# Altium schematic sheet PowerSupply.SchDoc: TermoDeep - Power Supply
size A4; Revision: V1.0 Rev A; Proyect DSD: TermoDeep; Version: V 1.0  Rev A
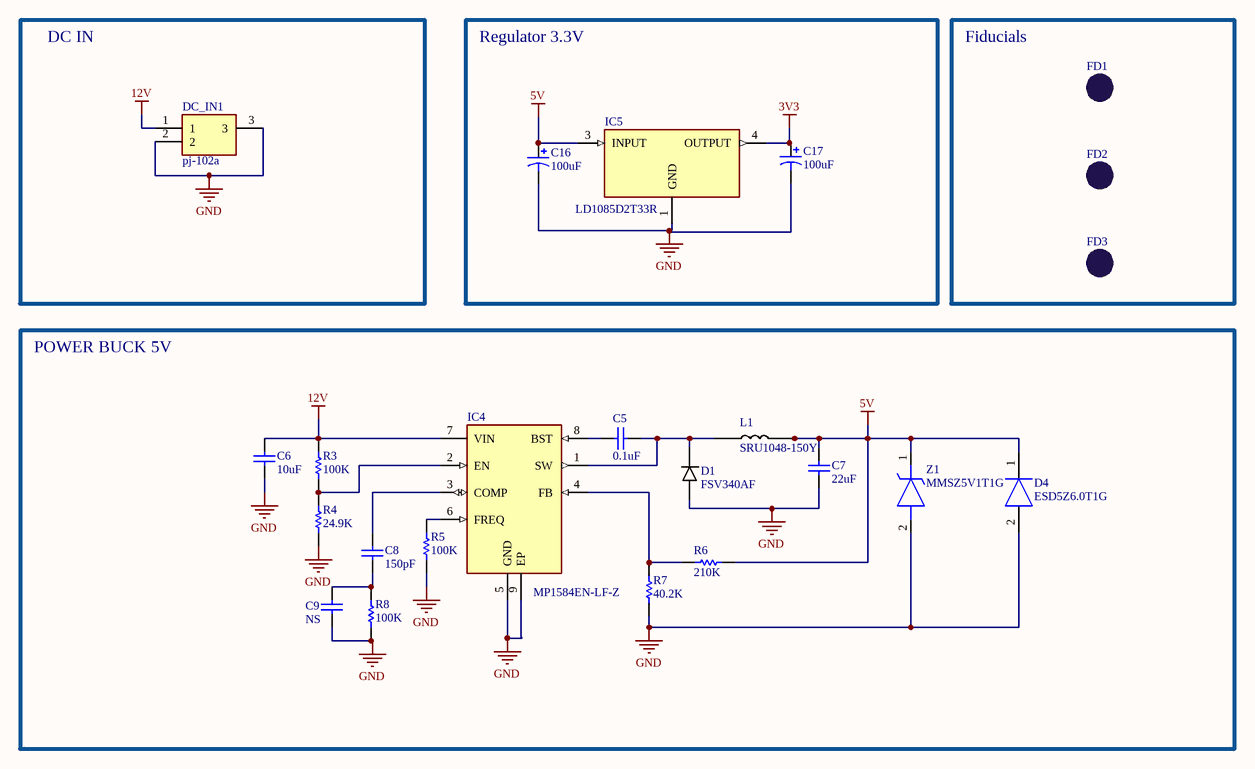
[diagram p0: PowerSupply.SchDoc]

## Parts
C5  0.1uF  [C0603_N]
C6  10uF  [C0805_N]
C7  22uF  [C0805_N]
C8  150pF  [C0603_N]
C9  NS  [C0603_N]
C16  100uF  [C_TANT_A_3216_N]
C17  100uF  [C_TANT_A_3216_N]
D1  FSV340AF  [SODFL4725X100N]
D4  ESD5Z6.0T1G  [SODFL1608X70N]
DC_IN1  pj-102a  [PJ059A]
FD1  Fiducial  [Fiducial]  (value not drawn)
FD2  Fiducial  [Fiducial]  (value not drawn)
FD3  Fiducial  [Fiducial]  (value not drawn)
IC4  MP1584EN-LF-Z  [SOIC127P600X170-9N]
IC5  LD1085D2T33R  [LD1085D2T33R]
L1  SRU1048-150Y  [SRU10486R8Y]
R3  100K  [R0603_N]
R4  24.9K  [R0603_N]
R5  100K  [R0603_N]
R6  210K  [R0603_N]
R7  40.2K  [R0603_N]
R8  100K  [R0603_N]
Z1  MMSZ5V1T1G  [SOD3716X135N]

## Blocks framed on the sheet
DC IN: DC_IN1
Regulator 3.3V: C16 C17 IC5
Fiducials: FD1-FD3
POWER BUCK 5V: C5-C9 D1 D4 IC4 L1 R3-R8 Z1

## Nets
3V3: C17.1 IC5.4(OUTPUT)
5V: C7.1 C16.1 D4.1(K) IC5.3(INPUT) L1.2 R6.1 Z1.1(K)
12V: C6.2 DC_IN1.1 IC4.7(VIN) R3.1
GND: C6.1 C7.2 C9.1 C16.2 C17.2 D1.2(A) D4.2(A) DC_IN1.2 DC_IN1.3 IC4.5(GND) IC4.9(EP) IC5.1(GND) R4.2 R5.2 R7.1 R8.2 Z1.2(A)
NetC5_1: C5.1 D1.1(K) IC4.1(SW) L1.1
NetC5_2: C5.2 IC4.8(BST)
NetC8_1: C8.1 C9.2 R8.1
NetC8_2: C8.2 IC4.3(COMP)
NetIC4_2: IC4.2(EN) R3.2 R4.1
NetIC4_4: IC4.4(FB) R6.2 R7.2
NetIC4_6: IC4.6(FREQ) R5.1

## Notes on the sheet
- Title
- Size:
- Date:
- A4
- Version
- Sheet
- of
- DeepSea Developments
- Cll  2A # 24C - 25
- Cali, Valle del Cauca
- Colombia
- www.dsd.dev
- Proyect:

## Library data of the parts
C5-C9 = C_SMD
  C5: Value: 0.1uF
  C6: Value: 10uF
  C7: Value: 22uF
  C8: Value: 150pF
  C9: Value: NS
C16 C17 = CP_SMD: Value: 100uF
D1 = FSV340AF: Diode; Manufacturer_Name: ON Semiconductor; Datasheet Link: https://componentsearchengine.com/Datasheets/1/FSV340AF.pdf; Height: 1mm; Manufacturer_Part_Number: FSV340AF; Mouser Part Number: 512-FSV340AF; Mouser Price/Stock: https://www.mouser.com/Search/Refine.aspx?Keyword=512-FSV340AF
D4 = ESD5Z6.0T1G: Diode; Manufacturer_Name: ON Semiconductor; Datasheet Link: http://www.onsemi.com/pub/Collateral/ESD5Z2.5T1-D.PDF; Height: 0.7mm; Manufacturer_Part_Number: ESD5Z6.0T1G; Arrow Part Number: ESD5Z6.0T1G; Arrow Price/Stock: https://www.arrow.com/en/products/esd5z6.0t1g/on-semiconductor; Mouser Part Number: 863-ESD5Z6.0T1G; Mouser Price/Stock: https://www.mouser.co.uk/ProductDetail/ON-Semiconductor/ESD5Z60T1G?qs=OSf9jACorvYUyIPFpvnErQ%3D%3D
DC_IN1 = PJ-059A: Connector; Manufacturer_Name: CUI Devices; Datasheet Link: https://www.cui.com/product/resource/digikeypdf/pj-059a.pdf; Height: 11.2mm; Manufacturer_Part_Number: PJ-059A; Mouser Part Number: 490-PJ-059A; Mouser Price/Stock: https://www.mouser.com/Search/Refine.aspx?Keyword=490-PJ-059A
IC4 = MP1584EN-LF-Z: Integrated Circuit; Manufacturer_Name: Monolithic Power Systems (MPS); Datasheet Link: https://componentsearchengine.com/Datasheets/1/MP1584EN-LF-Z.pdf; Height: 1.7mm; Manufacturer_Part_Number: MP1584EN-LF-Z; Mouser Part Number: 946-MP1584ENLFZ; Mouser Price/Stock: https://www.mouser.com/Search/Refine.aspx?Keyword=946-MP1584ENLFZ
IC5 = LD1085D2T33R: Integrated Circuit; Manufacturer_Name: STMicroelectronics; Allied_Number: 70407295; Datasheet Link: http://www.st.com/web/en/resource/technical/document/datasheet/CD00001883.pdf; Manufacturer_Part_Number: LD1085D2T33R; Mouser Part Number: 511-LD1085D2T33-TR; Mouser Price/Stock: https://www.mouser.com/Search/Refine.aspx?Keyword=511-LD1085D2T33-TR; RS Part Number: 6869209P; RS Price/Stock: http://uk.rs-online.com/web/p/products/6869209P; Allied Price/Stock: http://www.alliedelec.com/stmicroelectronics-ld1085d2t33r/70407295/
L1 = SRU1048-150Y: Inductor; Manufacturer_Name: Bourns; Datasheet Link: https://www.bourns.com/docs/Product-Datasheets/SRU1048.pdf; Height: 5mm; Manufacturer_Part_Number: SRU1048-150Y; Mouser Part Number: 652-SRU1048-150Y; Mouser Price/Stock: https://www.mouser.com/Search/Refine.aspx?Keyword=652-SRU1048-150Y; RS Part Number: 7633590P; RS Price/Stock: http://uk.rs-online.com/web/p/products/7633590P
R3-R8 = R_SMD: 1%
  R3 R5 R8: Value: 100K
  R4: Value: 24.9K
  R6: Value: 210K
  R7: Value: 40.2K
Z1 = MMSZ5V1T1G: Zener Diode; Manufacturer_Name: ON Semiconductor; Datasheet Link: http://docs-emea.rs-online.com/webdocs/078e/0900766b8078eb5b.pdf; Height: 1.35mm; Manufacturer_Part_Number: MMSZ5V1T1G; Arrow Part Number: MMSZ5V1T1G; Arrow Price/Stock: https://www.arrow.com/en/products/mmsz5v1t1g/on-semiconductor; Mouser Part Number: 863-MMSZ5V1T1G; Mouser Price/Stock: https://www.mouser.co.uk/ProductDetail/ON-Semiconductor/MMSZ5V1T1G?qs=ZpPixqFcBtyTVyk6YoEMxQ%3D%3D